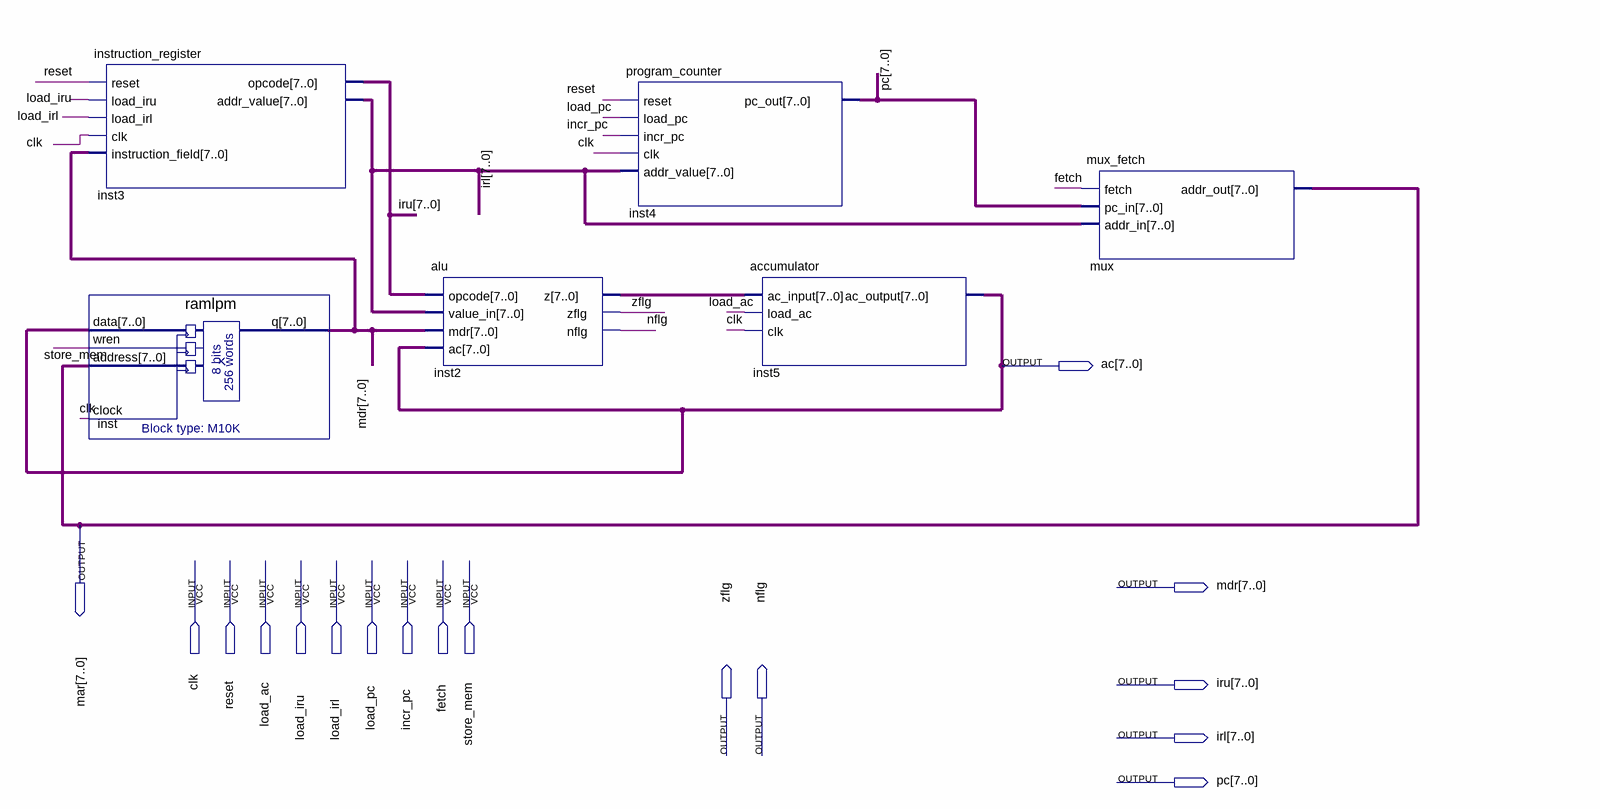
[diagram p0: schematic sheet]
// Quartus schematic lab7_tb.bdf as structural Verilog: 6 symbols, 17 pins
module lab7_tb (
  input  clk,
  input  reset,
  input  load_ac,
  input  load_iru,
  input  load_irl,
  input  load_pc,
  input  incr_pc,
  input  fetch,
  input  store_mem,
  output [7:0] ac,
  output [7:0] mar,
  output [7:0] mdr,
  output [7:0] iru,
  output [7:0] irl,
  output zflg,
  output nflg,
  output [7:0] pc
);

  wire [7:0] inst2_z;

  instruction_register inst3 (
    .reset(reset), .load_iru(load_iru), .load_irl(load_irl), .clk(clk), .instruction_field(mdr),
    .opcode(iru), .addr_value(irl));
  ramlpm inst (.data(ac), .wren(store_mem), .address(mar), .clock(clk), .q(mdr));
  alu inst2 (.opcode(iru), .value_in(irl), .mdr(mdr), .ac(ac), .z(inst2_z), .zflg(zflg), .nflg(nflg));
  program_counter inst4 (.reset(reset), .load_pc(load_pc), .incr_pc(incr_pc), .clk(clk), .addr_value(irl), .pc_out(pc));
  accumulator inst5 (.ac_input(inst2_z), .load_ac(load_ac), .clk(clk), .ac_output(ac));
  mux_fetch mux (.fetch(fetch), .pc_in(pc), .addr_in(irl), .addr_out(mar));
endmodule
